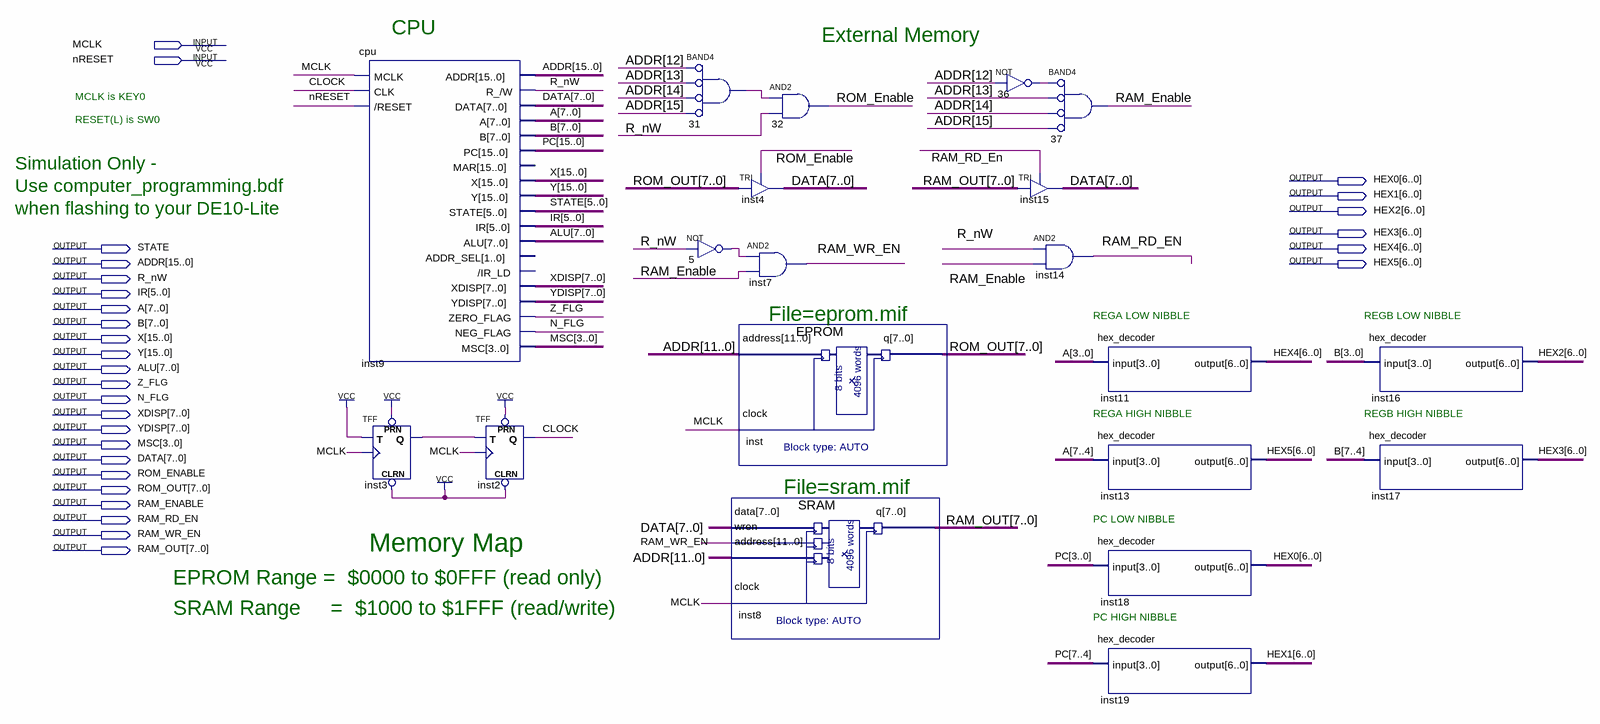
[diagram p0: schematic sheet]
// Quartus schematic computer_simulation.bdf as structural Verilog: 20 symbols, 29 pins
module computer_simulation (
  input  MCLK,
  input  nRESET,
  output [6:0] HEX0,
  output [6:0] HEX1,
  output [6:0] HEX2,
  output [6:0] HEX3,
  output STATE,
  output [6:0] HEX4,
  output [15:0] ADDR,
  output [6:0] HEX5,
  output R_nW,
  output [5:0] IR,
  output [7:0] A,
  output [7:0] B,
  output [15:0] X,
  output [15:0] Y,
  output [7:0] ALU,
  output Z_FLG,
  output N_FLG,
  output [7:0] XDISP,
  output [7:0] YDISP,
  output [3:0] MSC,
  output [7:0] DATA,
  output ROM_ENABLE,
  output [7:0] ROM_OUT,
  output RAM_ENABLE,
  output RAM_RD_EN,
  output RAM_WR_EN,
  output [7:0] RAM_OUT
);

  wire CLOCK, inst3_q, n5_out, n31_out, n36_out;
  wire [5:0] STATE_bus;
  wire [15:0] PC;

  cpu inst9 (
    .MCLK(MCLK), .CLK(CLOCK), .\/RESET (nRESET), .ADDR(ADDR), .\R_/W (R_nW), .A(A), .B(B), .PC(PC), .X(X),
    .Y(Y), .STATE(STATE_bus), .IR(IR), .ALU(ALU), .XDISP(XDISP), .YDISP(YDISP), .ZERO_FLAG(Z_FLG),
    .NEG_FLAG(N_FLG), .MSC(MSC), .DATA(DATA));  // open: MAR, ADDR_SEL, /IR_LD
  TFF inst3 (.PRN(1'b1), .CLRN(1'b1), .T(1'b1), .CLK(MCLK), .Q(inst3_q));
  TFF inst2 (.PRN(1'b1), .CLRN(1'b1), .T(inst3_q), .CLK(MCLK), .Q(CLOCK));
  and u_31 (n31_out, ~ADDR[12], ~ADDR[13], ~ADDR[14], ~ADDR[15]);  // BAND4
  not u_5 (n5_out, R_nW);
  and u_32 (ROM_ENABLE, n31_out, R_nW);
  TRI inst4[7:0] (.IN(ROM_OUT), .OE(ROM_ENABLE), .OUT(DATA));
  and inst7 (RAM_WR_EN, n5_out, RAM_ENABLE);
  EPROM inst (.address(ADDR[11:0]), .clock(MCLK), .q(ROM_OUT));
  SRAM inst8 (.data(DATA), .wren(RAM_WR_EN), .address(ADDR[11:0]), .clock(MCLK), .q(RAM_OUT));
  not u_36 (n36_out, ADDR[12]);
  TRI inst15[7:0] (.IN(RAM_OUT), .OE(RAM_RD_EN), .OUT(DATA));
  and u_37 (RAM_ENABLE, ~n36_out, ~ADDR[13], ~ADDR[14], ~ADDR[15]);  // BAND4
  and inst14 (RAM_RD_EN, R_nW, RAM_ENABLE);
  hex_decoder inst11 (.\input (A[3:0]), .\output (HEX4));
  hex_decoder inst13 (.\input (A[7:4]), .\output (HEX5));
  hex_decoder inst18 (.\input (PC[3:0]), .\output (HEX0));
  hex_decoder inst19 (.\input (PC[7:4]), .\output (HEX1));
  hex_decoder inst16 (.\input (B[3:0]), .\output (HEX2));
  hex_decoder inst17 (.\input (B[7:4]), .\output (HEX3));

  // Notes on the sheet:
  //   CPU
  //   External Memory
  //   MCLK is KEY0
  //   RESET(L) is SW0
  //   Simulation Only - 
  //   Use computer_programming.bdf
  //   when flashing to your DE10-Lite
  //   File=eprom.mif
  //   REGA LOW NIBBLE 
  //   REGB LOW NIBBLE 
  //   REGA HIGH NIBBLE 
  //   REGB HIGH NIBBLE 
  //   File=sram.mif
  //   PC LOW NIBBLE 
  //   Memory Map
  //   EPROM Range =  $0000 to $0FFF (read only)
  //   SRAM Range     =  $1000 to $1FFF (read/write)
  //   PC HIGH NIBBLE 
endmodule
